# Altium schematic sheet 无线.SchDoc: 无线
size A4; DocumentNumber: 2; Revision: 樊浩柏; SheetNumber: 2; SheetTotal: 6
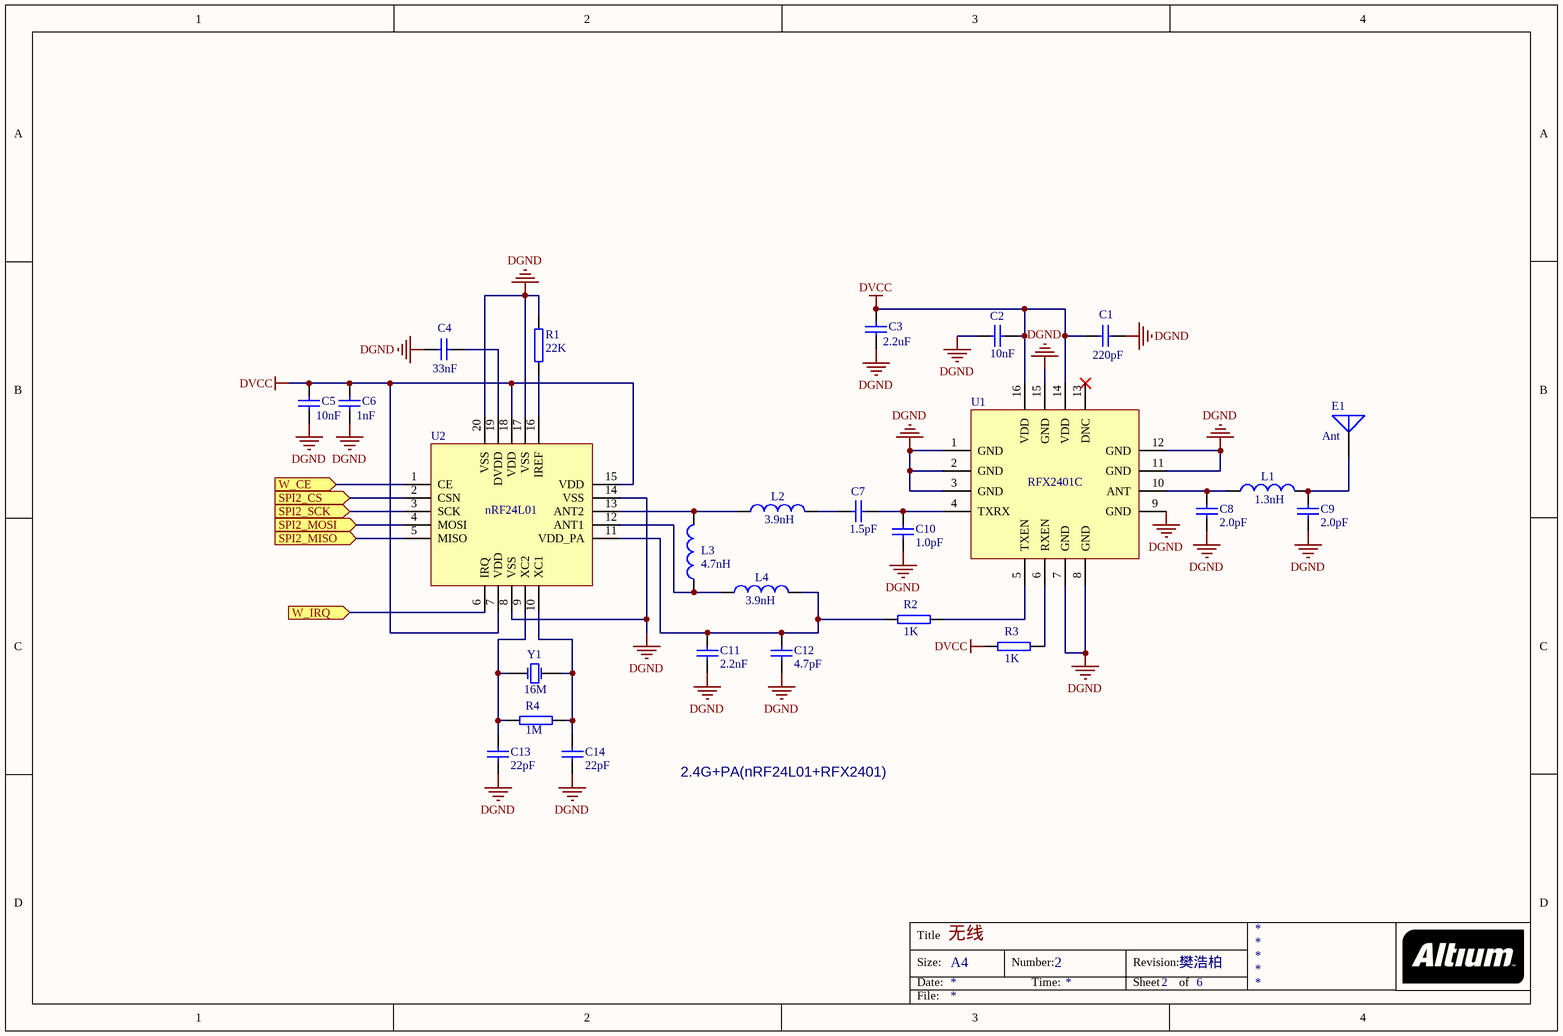
[diagram p0: 无线.SchDoc]

## Parts
C1  220pF  [CAP-0402]
C2  10nF  [CAP-0402]
C3  2.2uF  [CAP-0402]
C4  33nF  [CAP-0402]
C5  10nF  [CAP-0402]
C6  1nF  [CAP-0402]
C7  1.5pF  [CAP-0402]
C8  2.0pF  [CAP-0402]
C9  2.0pF  [CAP-0402]
C10  1.0pF  [CAP-0402]
C11  2.2nF  [CAP-0402]
C12  4.7pF  [CAP-0402]
C13  22pF  [CAP-0402]
C14  22pF  [CAP-0402]
E1  Ant  [ANT-SMD-5.0mm]
L1  1.3nH  [Chip Inductor-0402_100505]
L2  3.9nH  [Chip Inductor-0402_100505]
L3  4.7nH  [Chip Inductor-0402_100505]
L4  3.9nH  [Chip Inductor-0402_100505]
R1  22K  [RES-0402]
R2  1K  [RES-0402]
R3  1K  [RES-0402]
R4  1M  [RES-0402]
U1  RFX2401C  [QFN-16-3x3MM]
U2  nRF24L01  [QFN-20-4x4mm]
Y1  16M  [XTAL-OSC-3225]

## Ports
SPI2_CS (in), SPI2_MISO (in), SPI2_MOSI (in), SPI2_SCK (in), W_CE (in), W_IRQ

## Nets
DGND: C1.1 C2.2 C3.1 C4.2 C5.1 C6.1 C8.1 C9.1 C10.1 C11.1 C12.1 C13.1 C14.1 R1.2 U1.1(GND) U1.2(GND) U1.3(GND) U1.7(GND) U1.8(GND) U1.9(GND) U1.11(GND) U1.12(GND) U1.15(GND) U2.8(VSS) U2.14(VSS) U2.17(VSS) U2.20(VSS)
DVCC: C1.2 C2.1 C3.2 C5.2 C6.2 R3.2 U1.14(VDD) U1.16(VDD) U2.7(VDD) U2.15(VDD) U2.18(VDD)
SPI2_CS: U2.2(CSN) ; port SPI2_CS
SPI2_MISO: U2.5(MISO) ; port SPI2_MISO
SPI2_MOSI: U2.4(MOSI) ; port SPI2_MOSI
SPI2_SCK: U2.3(SCK) ; port SPI2_SCK
W_CE: U2.1(CE) ; port W_CE
W_IRQ: U2.6(IRQ) ; port W_IRQ
NetC4_1: C4.1 U2.19(DVDD)
NetC7_1: C7.1 C10.2 U1.4(TXRX)
NetC7_2: C7.2 L2.2
NetC8_2: C8.2 L1.1 U1.10(ANT)
NetC9_2: C9.2 E1.1 L1.2
NetC11_2: C11.2 C12.2 L4.2 R2.1 U2.11(VDD_PA)
NetC13_2: C13.2 R4.2 U2.9(XC2) Y1.1(OSC1)
NetC14_2: C14.2 R4.1 U2.10(XC1) Y1.3(OSC2)
NetL2_1: L2.1 L3.2 U2.13(ANT2)
NetL3_1: L3.1 L4.1 U2.12(ANT1)
NetR1_1: R1.1 U2.16(IREF)
NetR2_2: R2.2 U1.5(TXEN)
NetR3_1: R3.1 U1.6(RXEN)

Not connected (* = marked no-connect by the designer): U1 13(DNC)*

## Notes on the sheet
- 2.4G+PA(nRF24L01+RFX2401)
- Title
- Size:
- Date:
- A4
- Number:
- Time:
- Revision:
- Sheet
- of
- File:

## Library data of the parts
C1-C14 = Cap
L1-L4 = Inductor
R1-R4 = Res
Y1 = XTAL